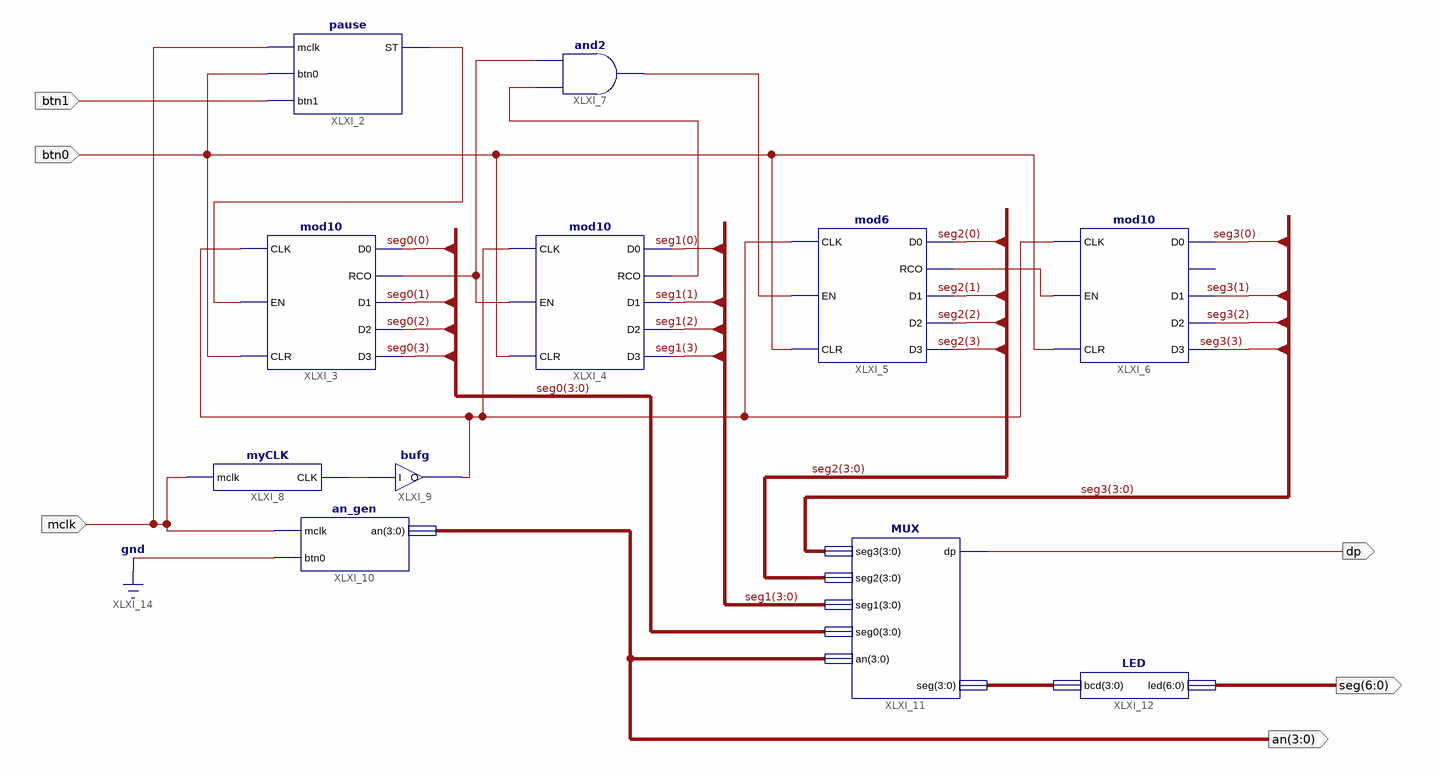
[diagram p0: schematic sheet 1]
// Xilinx ISE schematic lab3.sch (spartan3e) as structural Verilog: 11 symbols, 6 ports
module lab3 (
  input  btn0,
  input  mclk,
  input  btn1,
  output [3:0] an,
  output dp,
  output [6:0] seg
);

  wire XLXN_18, XLXN_21, XLXN_22, XLXN_23, XLXN_24, XLXN_27, XLXN_28;
  wire [3:0] seg0, seg1, seg2, seg3, XLXN_63;

  pause XLXI_2 (.mclk(mclk), .btn0(btn0), .btn1(btn1), .ST(XLXN_18));
  mod10 XLXI_3 (
    .CLK(XLXN_27), .EN(XLXN_18), .CLR(btn0), .D0(seg0[0]), .RCO(XLXN_21), .D1(seg0[1]), .D2(seg0[2]),
    .D3(seg0[3]));
  mod10 XLXI_4 (
    .CLK(XLXN_27), .EN(XLXN_21), .CLR(btn0), .D0(seg1[0]), .RCO(XLXN_22), .D1(seg1[1]), .D2(seg1[2]),
    .D3(seg1[3]));
  mod6 XLXI_5 (
    .CLK(XLXN_27), .EN(XLXN_23), .CLR(btn0), .D0(seg2[0]), .RCO(XLXN_24), .D1(seg2[1]), .D2(seg2[2]),
    .D3(seg2[3]));
  mod10 XLXI_6 (
    .CLK(XLXN_27), .EN(XLXN_24), .CLR(btn0), .D0(seg3[0]), .D1(seg3[1]), .D2(seg3[2]), .D3(seg3[3]));  // open: RCO
  and XLXI_7 (XLXN_23, XLXN_22, XLXN_21);
  myCLK XLXI_8 (.mclk(mclk), .CLK(XLXN_28));
  bufg XLXI_9 (.I(XLXN_28), .O(XLXN_27));
  an_gen XLXI_10 (.mclk(mclk), .btn0(1'b0), .an(an));
  MUX XLXI_11 (.seg3(seg3), .seg2(seg2), .seg1(seg1), .seg0(seg0), .an(an), .dp(dp), .seg(XLXN_63));
  LED XLXI_12 (.bcd(XLXN_63), .led(seg));
endmodule
